# EAGLE design TouScruino-ui1-v0 (EAGLE 6.3)
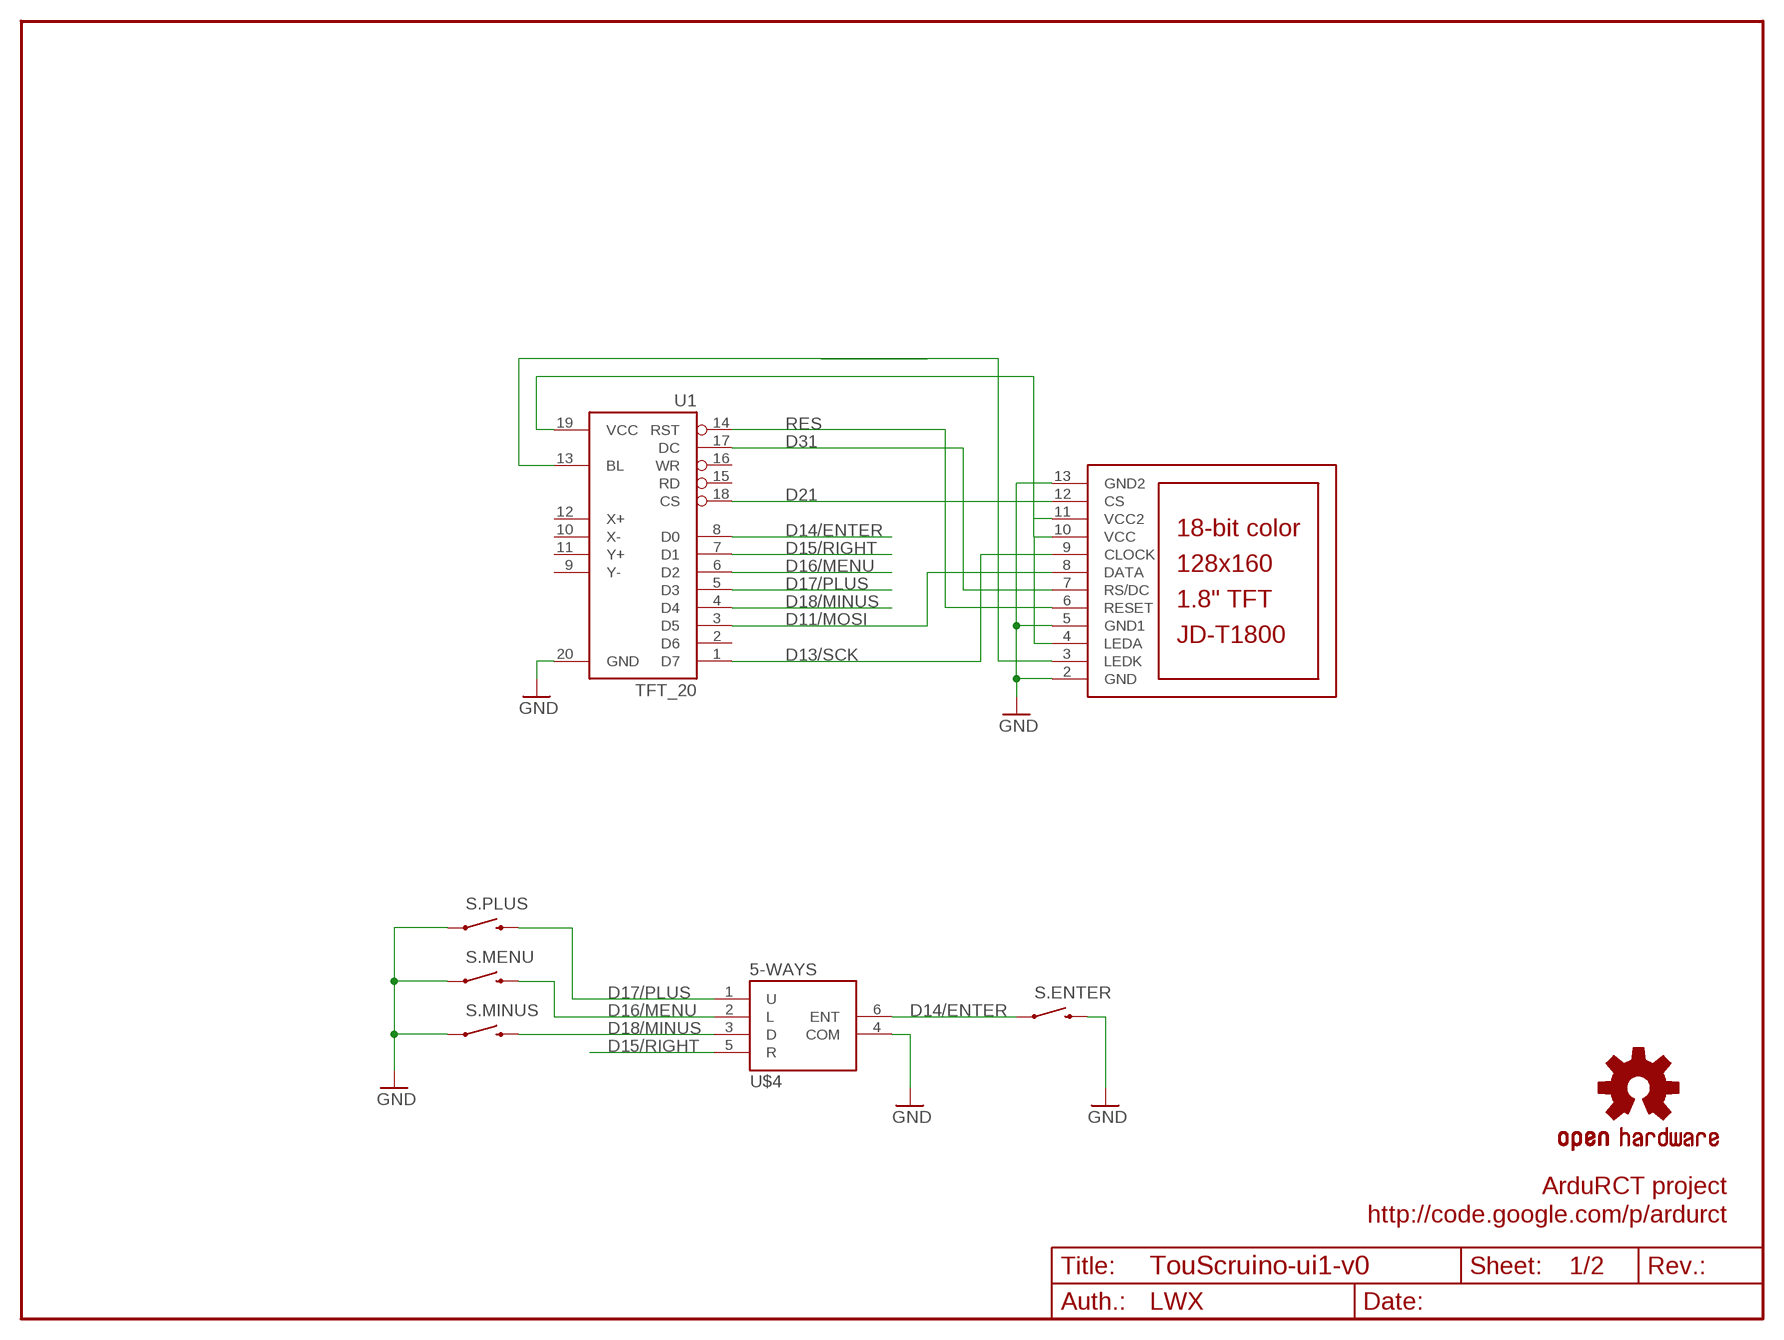
[diagram p0: schematic, sheet 1]

## Parts
LCD1  JD-T1800  [JD-T1800]
S.ENTER  SWITCH_SMD  [TACTILE_SWITCH_SMD]
S.MENU  SWITCH_SMD  [TACTILE_SWITCH_SMD]
S.MINUS  SWITCH_SMD  [TACTILE_SWITCH_SMD]
S.PLUS  SWITCH_SMD  [TACTILE_SWITCH_SMD]
U1  TFT_20  [TFT_20]
U$3  OSHW-LOGOM  [OSHW-LOGO-M]
U$4  5-WAYS  [5-WAYS_ALPS]

## Nets
BL: LCD1.3(LEDK) U1.13(BL)
D11/MOSI: LCD1.8(DATA) U1.3(D5)
D13/SCK: LCD1.9(CLOCK) U1.1(D7)
D14/ENTER: S.ENTER.1 U1.8(D0) U$4.6(ENT)
D15/RIGHT: U1.7(D1) U$4.5(R)
D16/MENU: S.MENU.3 U1.6(D2) U$4.2(L)
D17/PLUS: S.PLUS.3 U1.5(D3) U$4.1(U)
D18/MINUS: S.MINUS.3 U1.4(D4) U$4.3(D)
D21: LCD1.12(CS) U1.18(CS)
D31: LCD1.7(RS/DC) U1.17(DC)
GND: LCD1.2(GND) LCD1.5(GND1) LCD1.13(GND2) S.ENTER.3 S.MENU.1 S.MINUS.1 S.PLUS.1 U1.20(GND) U$4.4(COM)
RES: LCD1.6(RESET) U1.14(RST)
VCC: LCD1.4(LEDA) LCD1.10(VCC) LCD1.11(VCC2) U1.19(VCC)
Unconnected: U1.2(D6) U1.9(Y-) U1.10(X-) U1.11(Y+) U1.12(X+) U1.15(RD) U1.16(WR)

## Notes on the sheet
- ArduRCT project
- http://code.google.com/p/ardurct
- 1/2
- LWX

## Library data of the parts
LCD1 = adafruit:JD-T1800
S.ENTER S.MENU S.MINUS S.PLUS = wibauxl:SWITCH_SMD
U1 = wibauxl:TFT_20
U$3 = SparkFun:OSHW-LOGO: Open Source Hardware Logo This logo indicates the piece of hardware it is found on incorporates a OSHW license and/or adheres to the definition of open source hardware found here: http://freedomdefined.org/OSHW
U$4 = wibauxl:5-WAYS

## Net classes
0 default: width 0.203 mm
1 vcc: width 0.254 mm

## Board
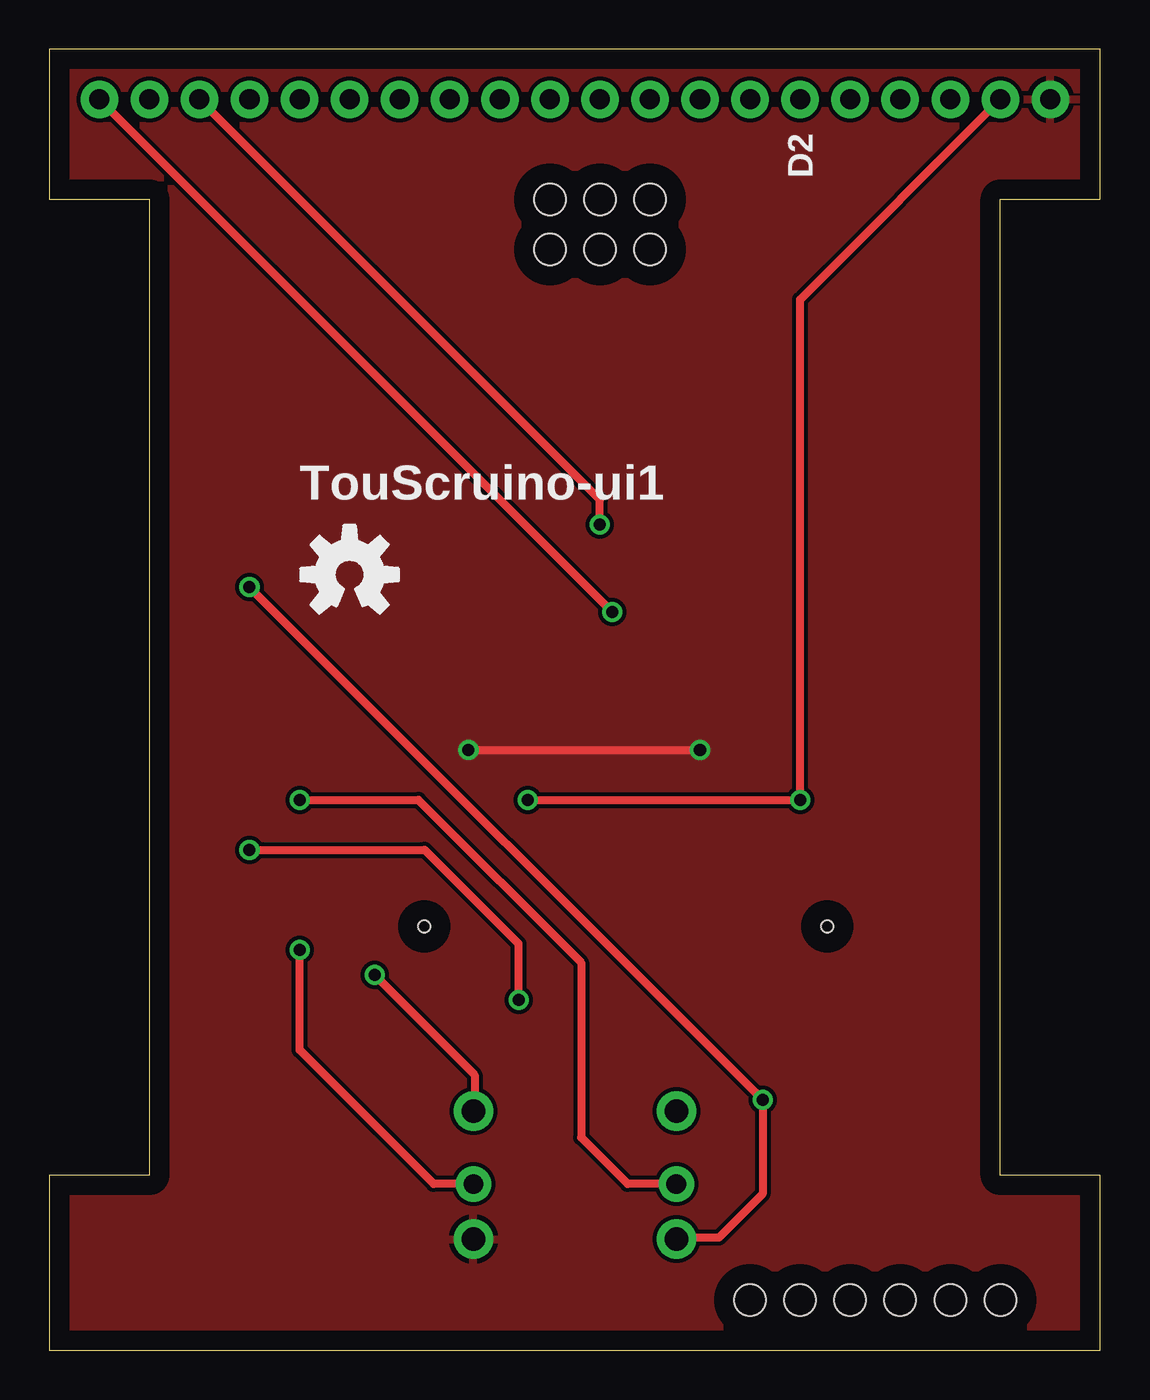
[diagram p1: board, top side]
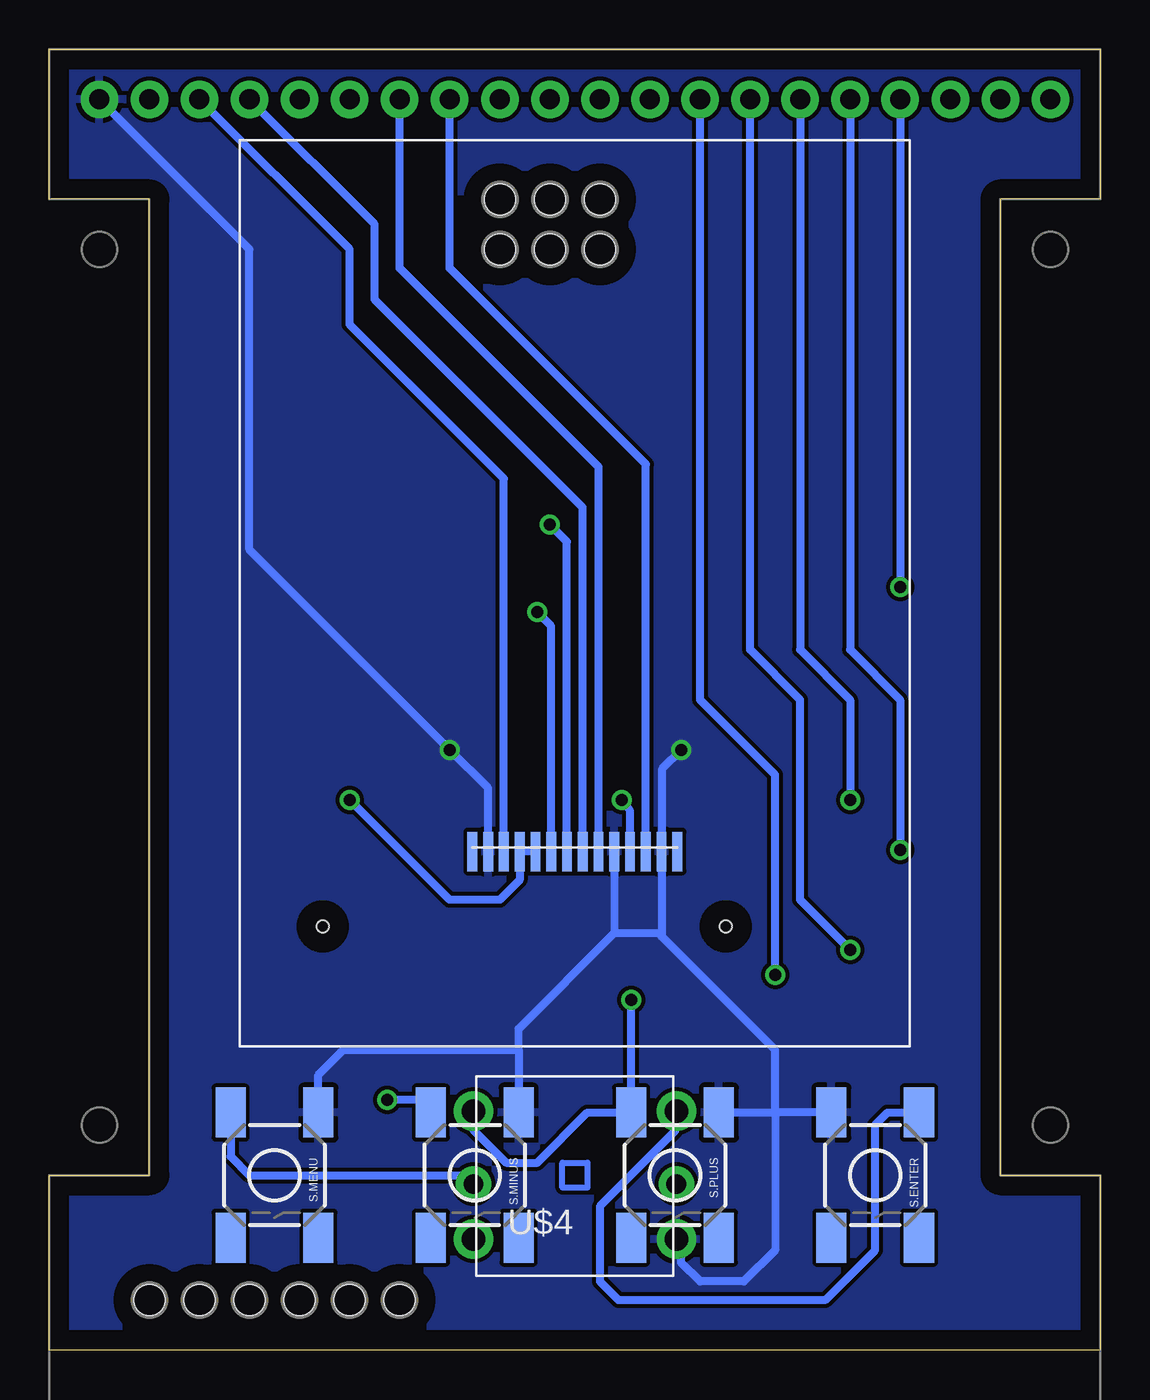
[diagram p2: board, bottom side, seen from below]

Size 53.34 x 66.04 mm. Coordinates in mm from the lower left corner, seen from the top.
Outline: 53.34,58.42 53.34,66.04 0,66.04 0,58.42 5.08,58.42 5.08,8.89 0,8.89 0,0 53.34,0 53.34,8.89 48.26,8.89 48.26,58.42 53.34,58.42
Copper layers (1*16): Top 0.035mm / dielectric 1.5mm / Bottom 0.035mm
Design rules "default": minimum track width 10mil, minimum drill 24mil, track to track 8mil, track to pad 8mil, pad to pad 8mil, via to via 8mil, smd to smd 8mil, copper to edge 40mil, drill to drill 8mil, minimum pad ring 10mil, minimum via ring 8mil, stop-mask expansion 4mil, vias tented up to drill 0mil, thermal gap 10mil
Holes 1.6 mm at 30.48,58.42 25.4,58.42 27.94,58.42 27.94,55.88 25.4,55.88 30.48,55.88 43.18,2.54 45.72,2.54 48.26,2.54 40.64,2.54 38.1,2.54 35.56,2.54

### Footprints (pad centres in the part's own frame; a part is rotated, then mirrored left to right if it is on the bottom)
JD-T1800 = smd 0.5 x 2: 1 5.2,-13.1; 2 4.4,-13.1; 3 3.6,-13.1; 4 2.8,-13.1; 5 2,-13.1; 6 1.2,-13.1; 7 0.4,-13.1; 8 -0.4,-13.1; 9 -1.2,-13.1; 10 -2,-13.1; 11 -2.8,-13.1; 12 -3.6,-13.1; 13 -4.4,-13.1; 14 -5.2,-13.1 | hole 0.61: -12.8,-16.9; 7.65,-16.9
TACTILE_SWITCH_SMD = smd 2.54 x 1.524: 1 -3.175,2.223; 2 3.175,2.223; 3 -3.175,-2.223; 4 3.175,-2.223
TFT_20 = drill 1.016 pad 1.905: 1 0,0; 2 -2.54,0; 3 -5.08,0; 4 -7.62,0; 5 -10.16,0; 6 -12.7,0; 7 -15.24,0; 8 -17.78,0; 9 -20.32,0; 10 -22.86,0; 11 -25.4,0; 12 -27.94,0; 13 -30.48,0; 14 -33.02,0; 15 -35.56,0; 16 -38.1,0; 17 -40.64,0; 18 -43.18,0; 19 -45.72,0; 20 -48.26,0
5-WAYS_ALPS = drill 1.2 pad 2: 1 -5.15,3.25; 3 -5.15,-3.25; 4 5.15,-3.25; 6 5.15,3.25 | drill 1 pad 1.8: 2 -5.15,-0.45; 5 5.15,-0.45

### Placement (x,y rotation side)
LCD1  26.67,38.42 0 bottom
S.ENTER  11.43,8.89 270 bottom
S.MENU  41.91,8.89 270 bottom
S.MINUS  31.75,8.89 270 bottom
S.PLUS  21.59,8.89 270 bottom
U1  2.54,63.5 0 bottom
U$3  15.24,39.37 0 top
U$4  26.67,8.89 0 bottom

### Tracks (layer width: path | path; a pad name or v marks a point on that pad's centre or on a via)
BL
  Bottom 0.406: LCD1.3 23.07,44.98 33.02,54.93 U1.13
D11/MOSI  (via drill 0.61)
  Top 0.406: v27.94,41.91 27.94,43.18 U1.3
  Bottom 0.406: LCD1.8 27.07,41.04 v27.94,41.91
D13/SCK  (via drill 0.61)
  Top 0.406: v28.57,37.47 U1.1
  Bottom 0.406: LCD1.9 27.87,36.76 v28.57,37.47
D14/ENTER  (via drill 0.61)
  Top 0.406: v16.51,19.05 21.59,13.97 21.59,12.21 U$4.6
  Bottom 0.406: U$4.6 21.59,12.21 21.59,11.11 25.4,7.3 25.4,3.49 24.45,2.54 13.97,2.54 11.43,5.08 11.43,11.43 10.79,12.06 S.ENTER.1 | v16.51,19.05 16.51,29.21 20.32,33.02 U1.8
D15/RIGHT  (via drill 0.61)
  Top 0.406: U$4.5 19.5,8.44 12.7,15.24 v12.7,20.32
  Bottom 0.406: v12.7,20.32 15.24,22.86 15.24,33.02 17.78,35.56 U1.7
D16/MENU  (via drill 0.61)
  Top 0.406: U$4.2 29.34,8.44 26.99,10.79 26.99,19.68 18.73,27.94 v12.7,27.94
  Bottom 0.406: S.MENU.3 44.13,9.84 43.18,8.89 32.27,8.89 U$4.2 | U1.6 15.24,35.56 12.7,33.02 v12.7,27.94
D17/PLUS  (via drill 0.61)
  Top 0.406: v10.16,25.4 19.05,25.4 23.81,20.64 v23.81,17.78
  Bottom 0.406: U$4.1 31.82,11.18 30.16,9.53 28.57,9.53 26.04,12.06 S.PLUS.3 v23.81,17.78 | U1.5 12.7,35.56 10.16,33.02 v10.16,25.4
D18/MINUS  (via drill 0.61)
  Top 0.406: U$4.3 31.89,5.71 33.97,5.71 36.2,7.94 v36.2,12.7 v10.16,38.73
  Bottom 0.406: S.MINUS.3 34.29,12.7 v36.2,12.7 | U1.4 v10.16,38.73
D21
  Bottom 0.406: LCD1.12 30.27,44.24 38.1,52.07 38.1,55.88 U1.18
D31
  Bottom 0.406: LCD1.7 26.27,42.78 36.83,53.34 36.83,57.15 U1.17
GND  (via drill 0.61)
  Top 0.406: v21.27,30.48 v33.02,30.48
  Bottom 0.406: U1.20 43.18,55.88 43.18,40.64 v33.02,30.48 31.07,28.53 LCD1.13 | LCD1.5 24.67,21.18 | v21.27,30.48 22.23,29.53 22.23,25.4 22.27,25.36 LCD1.2 22.27,21.27 | S.MENU.1 39.69,13.97 38.42,15.24 29.53,15.24 | 29.53,15.24 S.MINUS.1 | S.ENTER.3 16.51,12.06 | 29.53,15.24 29.53,16.32 24.67,21.18 | S.PLUS.1 16.51,12.06 | 16.51,12.06 16.51,15.24 22.27,21 22.27,21.27 | 16.51,12.06 16.51,5.08 18.1,3.49 20.32,3.49 21.27,4.45 21.27,5.39 U$4.4 | 24.67,21.18 22.36,21.18 22.27,21.27
  pour Top: 0,66.04 53.34,66.04 53.34,0 0,0
  pour Bottom: 0,66.04 53.34,66.04 53.34,0 0,0
RES
  Bottom 0.406: LCD1.6 25.47,44.84 35.56,54.93 U1.14
VCC  (via drill 0.61)
  Top 0.406: U1.19 38.1,53.34 v38.1,27.94 v24.29,27.94
  Bottom 0.406: v38.1,27.94 33.02,22.86 30.48,22.86 29.47,23.87 LCD1.11 LCD1.10 | LCD1.4 23.87,27.36 v24.29,27.94

### Text on the board
tPlace: D2 | TouScruino-ui1